# Altium schematic sheet Solar.SchDoc
size A4; SheetNumber: 1; SheetTotal: 2
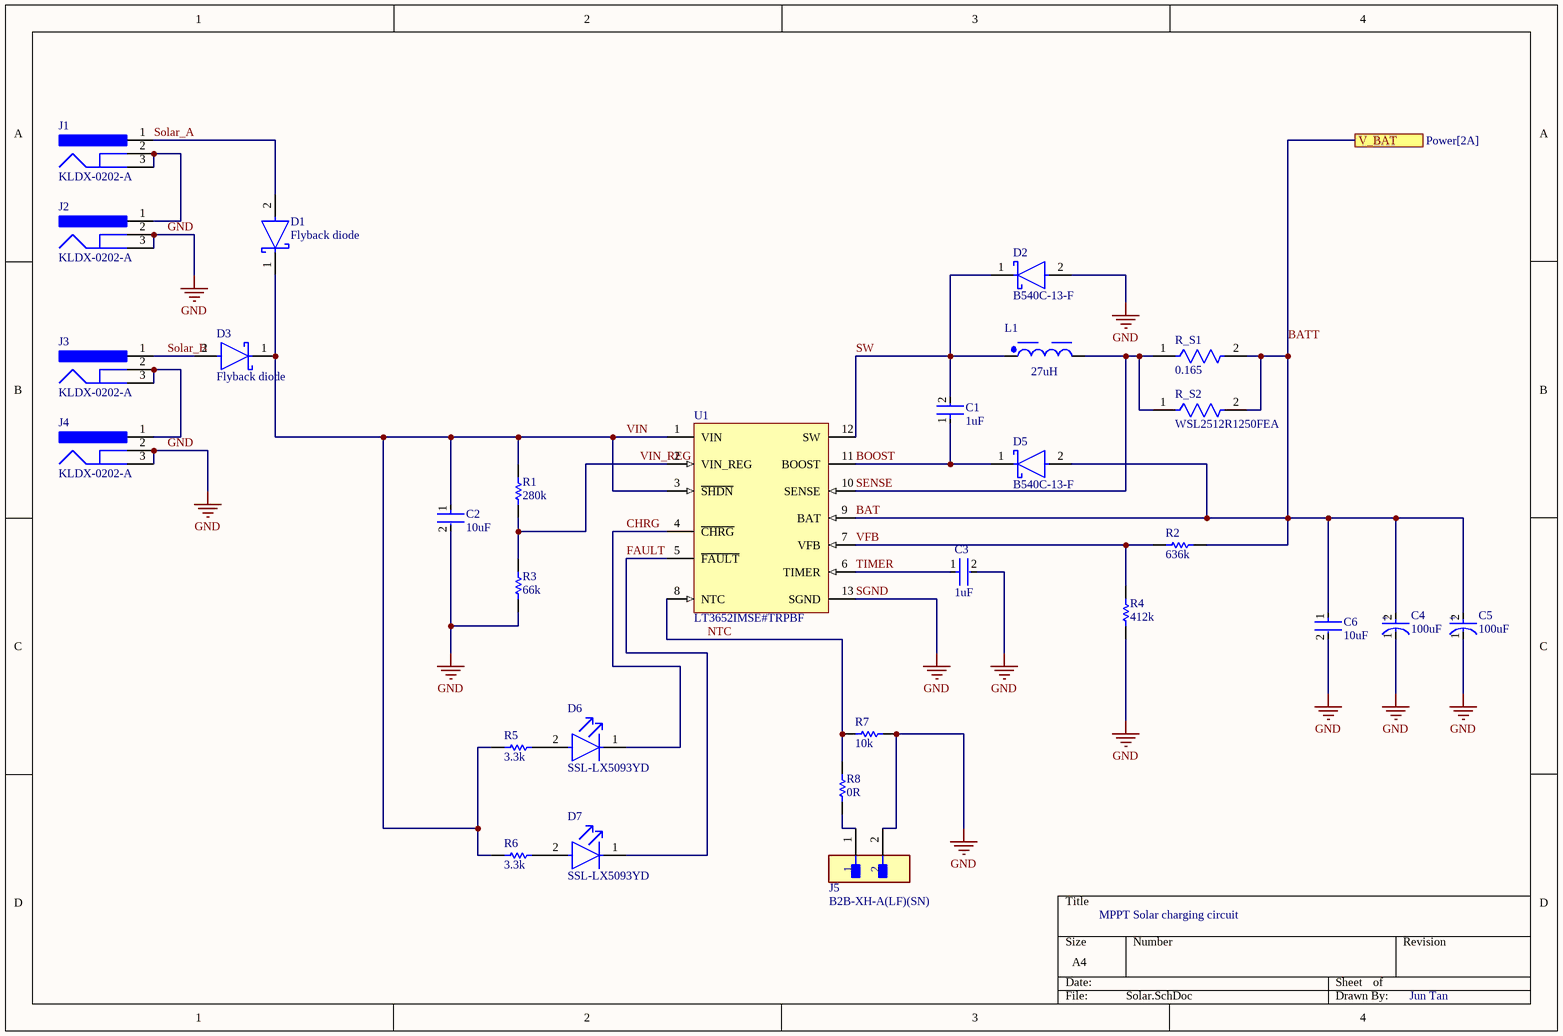
[diagram p0: Solar.SchDoc]

## Parts
C1  1uF  [FP-CC1206-1_25-MFG]
C2  10uF  [FP-GRM31C-0_2-e0_3_0_8-MFG]
C3  1uF  [FP-CC1206-1_25-MFG]
C4  100uF  [FP-RAD-TH-D_6_3_0_5-L_11-MFG]
C5  100uF  [FP-RAD-TH-D_6_3_0_5-L_11-MFG]
C6  10uF  [FP-GRM31C-0_2-e0_3_0_8-MFG]
D1  Flyback diode  [FP-DO-201AD-MFG]
D2  B540C-13-F  [FP-SMC-MFG]
D3  Flyback diode  [FP-DO-201AD-MFG]
D5  B540C-13-F  [FP-SMC-MFG]
D6  SSL-LX5093YD  [FP-SSL-LX5093YD-MFG]
D7  SSL-LX5093YD  [FP-SSL-LX5093YD-MFG]
J1  KLDX-0202-A  [KYCN-KLDX-0202-A_V]
J2  KLDX-0202-A  [KYCN-KLDX-0202-A_V]
J3  KLDX-0202-A  [KYCN-KLDX-0202-A_V]
J4  KLDX-0202-A  [KYCN-KLDX-0202-A_V]
J5  B2B-XH-A(LF)(SN)  [FP-B2B-XH-A_LF_SN-MFG]
L1  27uH  [WE-PD_7345R]
R1  280k  [RESA60-630X240]
R2  636k  [RESA60-630X240]
R3  66k  [RESA60-630X240]
R4  412k  [RESA60-630X240]
R5  3.3k  [RESA60-630X240]
R6  3.3k  [RESA60-630X240]
R7  10k  [RESA60-630X240]
R8  0R  [RESA60-630X240]
R_S1  0.165  [FP-WSL2512-MFG]
R_S2  WSL2512R1250FEA  [FP-WSL2512-MFG]
U1  LT3652IMSE#TRPBF  [LT-MSE-12-EDP_L]

## Ports
V_BAT (see Power[2A])

## Nets
GND: C2.2 C3.2 C4.1(C) C5.1(C) C6.2 D2.2(A) J2.2 J2.3 J4.2 J4.3 J5.2 R3.1 R4.1 R7.1 U1.13(SGND)  [also labelled SGND]
BAT: C4.2(A) C5.2(A) C6.1 D5.2(A) R2.1 R_S1.2 R_S2.2 U1.9(BAT) ; port V_BAT  [also labelled BATT]
BOOST: C1.1 D5.1(C) U1.11(BOOST)
CHRG: D6.1(C) U1.4(~{CHRG})
FAULT: D7.1(C) U1.5(~{FAULT})
NTC: R7.2 R8.2 U1.8(NTC)
SENSE: L1.2 R_S1.1 R_S2.1 U1.10(SENSE)
Solar_A: D1.2(A) J1.1
Solar_B: D3.2(A) J3.1
SW: C1.2 D2.1(C) L1.1 U1.12(SW)
TIMER: C3.1 U1.6(TIMER)
VFB: R2.2 R4.2 U1.7(VFB)
VIN: C2.1 D1.1(C) D3.1(C) R1.2 R5.2 R6.2 U1.1(VIN) U1.3(~{SHDN})
VIN_REG: R1.1 R3.2 U1.2(VIN_REG)
NetD6_2: D6.2(A) R5.1
NetD7_2: D7.2(A) R6.1
NetJ1_2: J1.2 J1.3 J2.1
NetJ3_2: J3.2 J3.3 J4.1
NetJ5_1: J5.1 R8.1

## Notes on the sheet
- MPPT Solar charging circuit
- Jun Tan
- (in symbol CMP-05427-000856-1) +

## Library data of the parts
C1 C3 = CMP-03422-001060-1: CAP CER 1UF 25V X7R 1206; Manufacturer: Yageo; Manufacturer Part Number: CC1206MKX7R8BB105; Automotive Grade: NA; Material: Ceramic; Temperature Coefficient: 15%; Tolerance: 0.2; Automotive: No; Category: Cap; Device Class L1: Passive Components; Voltage Rating: 25 V; Height: 1.45mm; Temperature Range Low: -55°C; Package: CC1206-1.25; ComponentLink2Description: Datasheet; Device Class L2: Capacitors; RoHS: TRUE; Capacitance: 1 uF; Temperature Characteristic: X7R; Temperature: -55°C to +125°C; Octopart: https://octopart.com/cc1206mkx7r8bb105-yageo-51849253; ComponentLink2URL: http://www.yageo.com/documents/recent/UPY-NP0X7R_HV_1KV-to-3KV_11.pdf; Temperature Range High: +125°C; Lead Free: Yes; Mouser Description: 1206 1 uF 25 V ±20% Tolerance X7R SMT Multilayer Ceramic Capacitor; Value: 1 uF; Footprint Url: http://www.yageo.com/exep/pages/download/literatures/UPY-C_GEN_24.pdf; Digikey Description: CAP CER 1UF 25V X7R 1206; Device Class L3: Ceramic Capacitors
C2 C6 = CMP-06035-003589-1: Chip Multilayer Ceramic Capacitors for General Purpose, 1206, 10uF, X7R, 15%, 10%, 25V; Case Code (Imperial): 1206; Voltage Rating (DC): 25V; Voltage Rating: 25V; Length: 3.2mm; Lead Free: Lead Free; Thickness: 0.071inch; Package Quantity: 1; Width: 1.6mm; Max Operating Temperature: 125°C; Number of Pins: 2; Height: 1.6mm; Case Code (Metric): 3216; REACH SVHC: No SVHC; Radiation Hardening: No; Case/Package: 1206; Material: Ceramic; Tolerance: 10%; Voltage: 25V; Mount: Surface Mount; Packaging: Tape and Reel; Dielectric: X7R; Termination: SMD/SMT; Min Operating Temperature: -55°C; Capacitance: 10uF; Depth: 1.6mm
C4 C5 = CMP-05427-000856-1: Aluminum Electrolytic Capacitors (Radial Lead Type) 100uF ±20% 25V; Lead Diameter: 0.5mm; Polarity: Polar; Ripple Current: 455mA; Impedance: 130mR; Life (Hours): 2000Hour; Length: 11mm; Min Operating Temperature: -40°C; Termination: Radial; Diameter: 6mm; Lead Pitch: 5mm; Tolerance: 20%; Capacitance: 100uF; Case/Package: Radial; Voltage Rating (DC): 25V; Height - Seated (Max): 0.5inch; RoHS Compliant: Yes; Series: FM; Package Quantity: 2000; Voltage Rating: 25V; Max Operating Temperature: 105°C; Mount: Through Hole; ESR (Equivalent Series Resistance): 130mR; Packaging: Tape and Reel
D1 D3 = CMP-12187-000025-1: DIODE SCHOTTKY 40V 3A DO201AD; Manufacturer Part Number: 1N5822; Manufacturer: STMicroelectronics; Max Junction Temp: +150°C; Peak Reverse Current: 2mA; Max Surge Forward Current: 80A; Temperature Range High: +150°C; Automotive: No; RoHS: TRUE; ComponentLink2Description: Datasheet; Lead Free: Yes; Octopart: https://octopart.com/1n5822-stmicroelectronics-323225; Device Class L2: Diodes; Max Repetitive Reverse Voltage: 40V; Temperature: to +150°C; Height: 5.3mm; Category: Diode; Digikey Description: DIODE SCHOTTKY 40V 3A DO201AD; ComponentLink2URL: https://www.st.com/resource/en/datasheet/1n5822.pdf; Device Class L3: Schottky Diodes; Device Class L1: Discrete Semiconductors; Forward Current: 3A; Mouser Description: Schottky Diodes & Rectifiers Vr/40V Io/3A BULK; Package: DO-201AD
D2 D5 = CMP-2000-05097-3: DIODE SCHOTTKY 40V 5A SMC; Manufacturer: Diodes Inc.; Automotive Grade: NA; Peak Reverse Current: 0.5mA; Value: 300pF; Max Junction Temp: +150°C; Max Surge Forward Current: 100A; Standoff Height: 0.1mm; Digikey Description: DIODE SCHOTTKY 40V 5A SMC; Temperature Range Low: -55°C; Manufacturer Part Number: B540C-13-F; Octopart: https://octopart.com/b540c-13-f-diodes+inc.-325873; Lead Free: Yes; Reverse Voltage: 40V; RoHS: TRUE; Category: Diode; Mouser Description: Diode: Schottky rectifying; SMD; 40V; 5A; SMC; Package: reel, tape; ComponentLink2Description: Datasheet; Temperature Range High: +150°C; Automotive: No; Footprint Url: https://www.diodes.com/assets/Package-Files/SMC.pdf; Device Class L3: Schottky Diodes; Height: 2.5mm; Forward Current: 5A; Temperature: -55°C to +150°C; Package: SMC; ComponentLink2URL: https://www.diodes.com/assets/Datasheets/ds13012.pdf; Device Class L2: Diodes; Max Repetitive Reverse Voltage: 40V; Device Class L1: Discrete Semiconductors; Capacitance: 300pF
D6 D7 = CMP-57192-000007-1: LED YELLOW DIFFUSED T-1 3/4 T/H; Test Current: 20mA; Number of LEDs: 1; Dominant Wavelength: 568nm; Wavelength: 585nm; Forward Voltage: 2.1V; Lens Style: Dome; Viewing Angle: 60°; Luminous Intensity: 30mcd; Min Operating Temperature: -40°C; Packaging: Bulk; Width: 1.5inch; Lead Free: Lead Free; Number of Pins: 2; Color: Yellow; Case/Package: Radial; Forward Current: 20mA; REACH SVHC: No SVHC; Lens Transparency: Diffused; Weight: 0.01lb; Height: 8.6mm; Package Quantity: 1000; Series: -; Length: 0.5inch; Illumination Color: Yellow; Mount: Through Hole; Diameter: 5mm; RoHS Compliant: Yes; Lens Color: Yellow; Max Operating Temperature: 85°C
J1-J4 = CMP-1673-00001-5: DC Power Jack, 24 V, 3.5 A, -25 to 85 degC, 3-Pin THD, RoHS; Manufacturer: Kycon; Voltage Rating: 24 V; Current Rating: 3.5 A; Height: 10.8 mm; Length: 9.2 mm; Pins: 2; Housing Material: PBT; Connector Type: Power; ComponentLink2URL: http://www.kycon.com/Pub_Eng_Draw/KLDX-0202-X.PDF; PackageDescription: 3-Pin Through Hole Device, Body 14.5 x 9 mm; Max Operating Temperature: 85 degC; Min Operating Temperature: -25 degC; PackageReference: KLDX-0202-A; Contact Gender: Female; Package Quantity: 500; Mount: Through Hole; Colour: Black; Contact Plating: Tin; DatasheetVersion: Rev. D3, 06/2013; ComponentLink2Description: Datasheet; RoHSCompliant: true; Mounting Technology: Through Hole; ComponentLink1Description: Manufacturer URL; Contact Material: Brass; ComponentLink1URL: http://www.kycon.com/
J5 = CMP-2000-05888-3: CONN HEADER VERT 2POS 2.5MM; Current Rating: 3A; Voltage Rating: 250V; Number of Contacts: 2; Contact Resistance: 20mR; Wire/Cable Gauge: 22AWG; Insulation Resistance: 1GR; Connector Type: Male Pin; Packaging: Bulk; Contact Material: Brass; Lead Free: Lead Free; Orientation: Straight; Contact Plating: Tin; Max Current Rating: 3A; Termination: Solder; Fastening Type: Detent; Depth: 5.75mm; Housing Material: Polyamide; REACH SVHC: No SVHC; Series: XH; Voltage Rating (AC): 250V; Number of Positions: 2; Color: Natural; Contact Type: Male Pin; Max Voltage Rating (DC): 250V; Pitch: 2.5mm; Lead Pitch: 2.5mm; Mount: Through Hole; Max Operating Temperature: 85°C; Length: 7.4mm; Max Voltage Rating (AC): 250V; Min Operating Temperature: -25°C; Number of Rows: 1; Housing Color: White
L1 = CMP-1396-00053-3: WE-PD Robust SMT Shielded Power Inductor; Self Resonant Frequency: 13MHz; RMS Current (Irms): 1.24A; Inductance: 27µH; Test Frequency: 1kHz; Tolerance: 20%; Series Resistance: 150mΩ; Saturation Current: 1.55A; Core Material: Ferrite; DC Resistance (DCR): 120mΩ; Ambient Temperature Range Low: -40°C; Ambient Temperature Range High: 85°C; Mount: Surface Mount; Length: 7.3mm; Max Operating Temperature: 125°C; Min Operating Temperature: -40°C; Max DC Current: 1.24A; Case/Package: Nonstandard; Depth: 7.3mm; Composition: Wirewound; Inductance Tolerance: 20%; RoHS: Compliant; Resistance: 150mΩ; Height - Seated (Max): 4.4958mm; Number of Pins: 2; Shielding: Shielded; REACH SVHC: Unknown; Width: 7.3mm; Current Rating: 1.24A; Termination: SMD/SMT; Height: 4.5mm
R1-R8 = CMP-1659-00071-1: Axial Resistor, 100 Ohm, +/- 1%, 0.25 W, -55 to 155 degC, 2-Pin THD, RoHS, Bulk; Voltage Rating: 250 V; Resistance: 4.75 kohm; Power Rating: 250 mW; Type (Resistor): Metal Film; Package Quantity: 200; RoHSCompliant: true; ComponentLink1URL: http://www.yageo.com/; ComponentLink1Description: Manufacturer URL; Case\Package: Axial; ComponentLink2Description: Datasheet; Length: 0.248 inch; PackageReference: MFR-25; Max Operating Temperature: 155 degC; Min Operating Temperature: -55 degC; DatasheetVersion: Apr-13; Mount: Through Hole; PackageDescription: 2-Pin Axial Lead, Dia 2.4 mm, Body Length 6.3 mm; Packaging: Bulk; Tolerance: 1%; ComponentLink2URL: http://www.yageo.com/documents/recent/Yageo%20LR_MFR_2013.pdf
R_S1 R_S2 = CMP-02407-012716-1: Res Metal Strip 2512 0.125 Ohm 1% 1W ±75ppm/°C Molded SMD SMD Embossed Plastic T/R; Resistance: 125mR; Packaging: Tape and Reel; RoHS Compliant: Yes; Resistor Type: Metal Strip; Max Operating Temperature: 170°C; Length: 6.35mm; Width: 3.17mm; Height: 635um; Temperature Coefficient: 75ppm/°C; Min Operating Temperature: -65°C; Case/Package: 2512; Lead Free: Lead Free; Radiation Hardening: No; Tolerance: 1%; Contact Plating: Tin; Power Rating: 1W
U1 = CMP-0473-00135-1: Power Tracking 2 A Battery Charger for Solar Power, 12-pin SOP (MSE-12-EDP), -40 to 125 degC, Pb-Free, Tape and Reel; Manufacturer: Linear Technology; Number of Outputs: 1; Vin Max(V): 32; Vin Min(V): 4.95; PackageDescription: 12-Pin Plastic MSOP, Exposed Die Pad, Body 4.039 x 3 mm, Pitch 0.65 mm; DatasheetVersion: Rev. D; ComponentLink3Description: Package Specification; Energy Source: Solar; PartNumber: LT3652IMSE#TRPBF; ComponentLink2URL: http://cds.linear.com/docs/en/datasheet/3652fd.pdf; PackageVersion: Rev. G, 05/2013; ComponentLink1Description: Manufacturer URL; Packing: Tape and Reel; Mounting Technology: Surface Mount; ComponentLink1URL: http://www.linear.com/; ComponentLink2Description: Datasheet; PackageReference: MSE-12-EDP; Topology: Battery Charger; RoHS: TRUE; ComponentLink3URL: http://cds.linear.com/docs/en/packaging/05081666_G_MSE12.pdf